# Altium schematic sheet 13_Periphs.SchDoc: Peripherals
size A3; Organization: Lime Microsystems; Address1: Surrey Tech Centre; Address2: Guildford GU2 7YG; Address3: Surrey; Address4: United Kingdom; Revision: v1.3; SheetNumber: 13; SheetTotal: 16
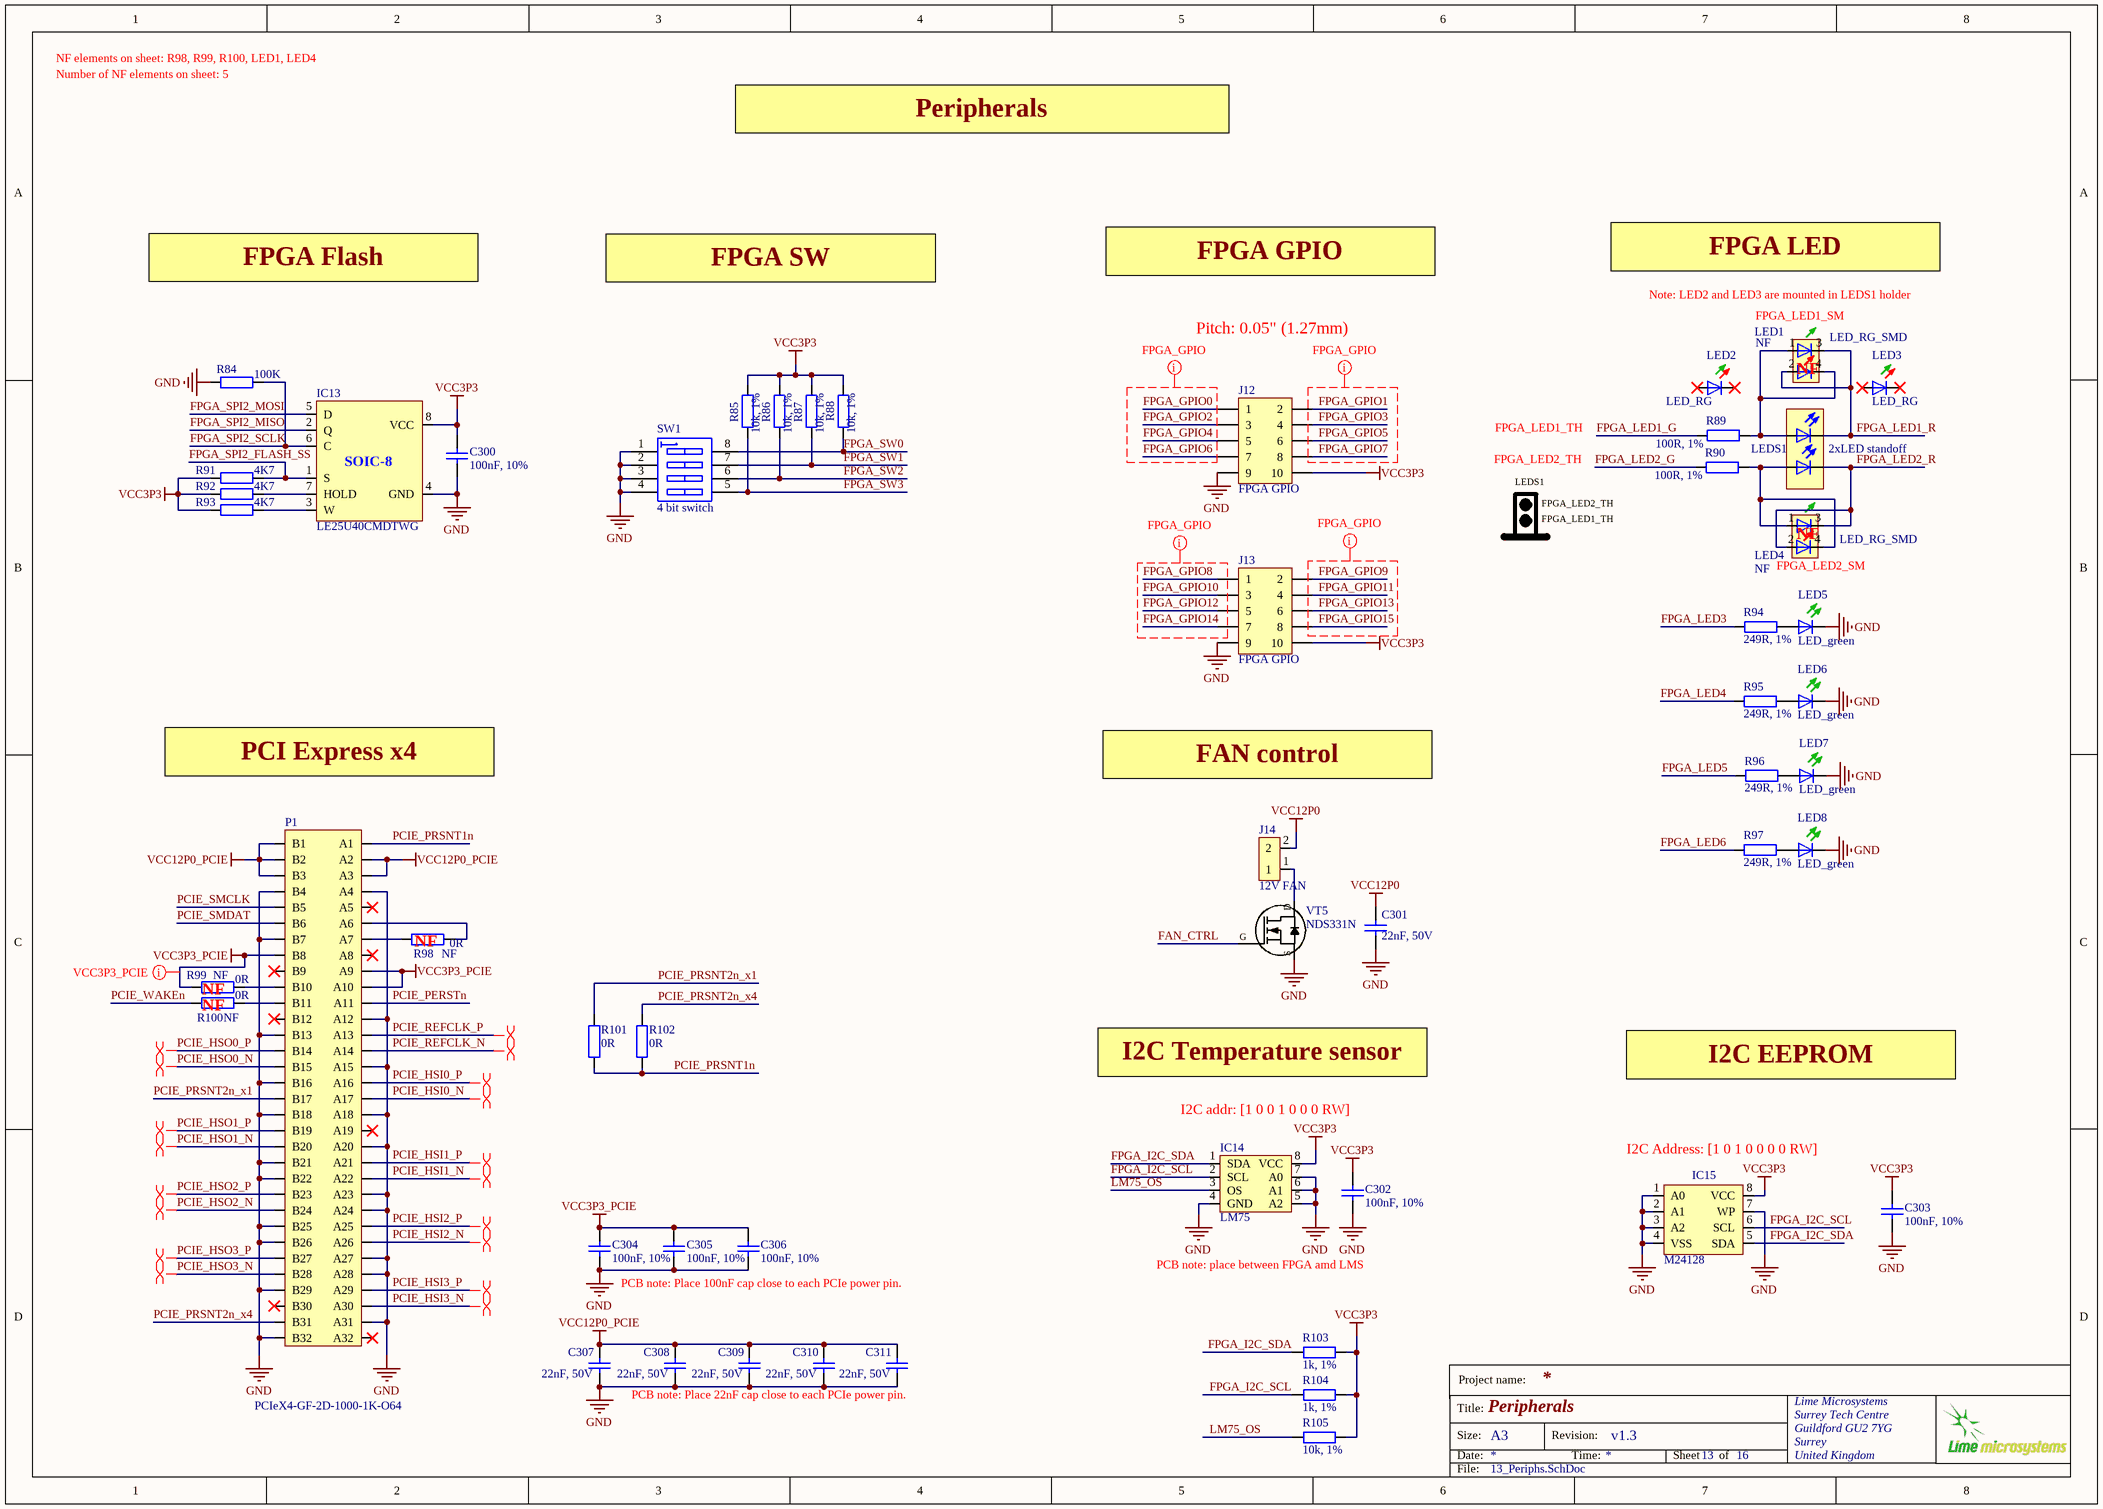
[diagram p0: 13_Periphs.SchDoc]

## Parts
C300  100nF, 10%  [CAP0402]
C301  22nF, 50V  [CAP0402]
C302  100nF, 10%  [CAP0402]
C303  100nF, 10%  [CAP0402]
C304  100nF, 10%  [CAP0402]
C305  100nF, 10%  [CAP0402]
C306  100nF, 10%  [CAP0402]
C307  22nF, 50V  [CAP0402]
C308  22nF, 50V  [CAP0402]
C309  22nF, 50V  [CAP0402]
C310  22nF, 50V  [CAP0402]
C311  22nF, 50V  [CAP0402]
IC13  LE25U40CMDTWG  [M25P40-VMN6TPB_SO8N]
IC14  LM75  [HWSON8_LM75]
IC15  M24128  [24FC512]
J12  FPGA GPIO  [SWD_10_pin]
J13  FPGA GPIO  [SWD_10_pin]
J14  12V FAN  [HDR_1x2]
LED1  LED_RG_SMD  Assembly Info: NF  [LED-2x0603]
LED2  LED_RG  (mechanical)
LED3  LED_RG  (mechanical)
LED4  LED_RG_SMD  Assembly Info: NF  [LED-2x0603]
LED5  LED_green  [LED-0603-GREEN]
LED6  LED_green  [LED-0603-GREEN]
LED7  LED_green  [LED-0603-GREEN]
LED8  LED_green  [LED-0603-GREEN]
LEDS1  2xLED standoff  [LED_STANDOFF_H-201C]
P1  PCIeX4-GF-2D-1000-1K-O64  [PCIeX4-GF-2D-1000-1K-O64]  (no BOM)
R84  100K  [RES0402]
R85  10k, 1%  [RES0402]
R86  10k, 1%  [RES0402]
R87  10k, 1%  [RES0402]
R88  10k, 1%  [RES0402]
R89  100R, 1%  [RES0402]
R90  100R, 1%  [RES0402]
R91  4K7  [RES0402]
R92  4K7  [RES0402]
R93  4K7  [RES0402]
R94  249R, 1%  [RES0402]
R95  249R, 1%  [RES0402]
R96  249R, 1%  [RES0402]
R97  249R, 1%  [RES0402]
R98  0R  Assembly Info: NF  [RES0402]
R99  0R  Assembly Info: NF  [RES0402]
R100  0R  Assembly Info: NF  [RES0402]
R101  0R  [RES0402]
R102  0R  [RES0402]
R103  1k, 1%  [RES0402]
R104  1k, 1%  [RES0402]
R105  10k, 1%  [RES0402]
SW1  4 bit switch  [SW_4WAY_SMD_1P27]
VT5  NDS331N  [SOT23-3]

## Nets
GND: C300.2 C301.2 C302.2 C303.2 C304.2 C305.2 C306.2 C307.2 C308.2 C309.2 C310.2 C311.2 IC13.4(GND) IC14.4(GND) IC14.5(A2) IC14.6(A1) IC14.7(A0) IC15.1(A0) IC15.2(A1) IC15.3(A2) IC15.4(VSS) IC15.7(WP) J12.9 J13.9 LED5.K(C) LED6.K(C) LED7.K(C) LED8.K(C) P1.A4 P1.A12 P1.A15 P1.A18 P1.A20 P1.A23 P1.A24 P1.A27 P1.A28 P1.A31 P1.B4 P1.B7 P1.B13 P1.B16 P1.B18 P1.B21 P1.B22 P1.B25 P1.B26 P1.B29 P1.B32 R84.1 SW1.1(A1) SW1.2(A2) SW1.3(A3) SW1.4(A4) VT5.S
VCC3P3: C300.1 C302.1 C303.1 IC13.8(VCC) IC14.8(VCC) IC15.8(VCC) J12.10 J13.10 R85.1 R86.1 R87.1 R88.1 R91.1 R92.1 R93.1 R103.1 R104.1 R105.1
VCC3P3_PCIE: C304.1 C305.1 C306.1 P1.A9 P1.A10 P1.B8 R99.1
VCC12P0: C301.1 J14.2
VCC12P0_PCIE: C307.1 C308.1 C309.1 C310.1 C311.1 P1.A2 P1.A3 P1.B1 P1.B2 P1.B3
FAN_CTRL: VT5.G
FPGA_GPIO0: J12.1
FPGA_GPIO1: J12.2
FPGA_GPIO2: J12.3
FPGA_GPIO3: J12.4
FPGA_GPIO4: J12.5
FPGA_GPIO5: J12.6
FPGA_GPIO6: J12.7
FPGA_GPIO7: J12.8
FPGA_GPIO8: J13.1
FPGA_GPIO9: J13.2
FPGA_GPIO10: J13.3
FPGA_GPIO11: J13.4
FPGA_GPIO12: J13.5
FPGA_GPIO13: J13.6
FPGA_GPIO14: J13.7
FPGA_GPIO15: J13.8
FPGA_I2C_SCL: IC14.2(SCL) IC15.6(SCL) R104.2
FPGA_I2C_SDA: IC14.1(SDA) IC15.5(SDA) R103.2
FPGA_LED1_G: R89.1
FPGA_LED1_R: LED1.2 LED1.3 LEDS1.K1(C)
FPGA_LED2_G: R90.1
FPGA_LED2_R: LED4.2 LED4.3 LEDS1.K2(C)
FPGA_LED3: R94.1
FPGA_LED4: R95.1
FPGA_LED5: R96.1
FPGA_LED6: R97.1
FPGA_SPI2_FLASH_SS: IC13.1(S) R91.2
FPGA_SPI2_MISO: IC13.2(Q)
FPGA_SPI2_MOSI: IC13.5(D)
FPGA_SPI2_SCLK: IC13.6(C) R84.2
FPGA_SW0: R88.2 SW1.8(B1)
FPGA_SW1: R87.2 SW1.7(B2)
FPGA_SW2: R86.2 SW1.6(B3)
FPGA_SW3: R85.2 SW1.5(B4)
LM75_OS: IC14.3(OS) R105.2
PCIE_HSI0_N: P1.A17
PCIE_HSI0_P: P1.A16
PCIE_HSI1_N: P1.A22
PCIE_HSI1_P: P1.A21
PCIE_HSI2_N: P1.A26
PCIE_HSI2_P: P1.A25
PCIE_HSI3_N: P1.A30
PCIE_HSI3_P: P1.A29
PCIE_HSO0_N: P1.B15
PCIE_HSO0_P: P1.B14
PCIE_HSO1_N: P1.B20
PCIE_HSO1_P: P1.B19
PCIE_HSO2_N: P1.B24
PCIE_HSO2_P: P1.B23
PCIE_HSO3_N: P1.B28
PCIE_HSO3_P: P1.B27
PCIE_PERSTn: P1.A11
PCIE_PRSNT1n: P1.A1 R101.1 R102.1
PCIE_PRSNT2n_x1: P1.B17 R101.2
PCIE_PRSNT2n_x4: P1.B31 R102.2
PCIE_REFCLK_N: P1.A14
PCIE_REFCLK_P: P1.A13
PCIE_SMCLK: P1.B5
PCIE_SMDAT: P1.B6
PCIE_WAKEn: R100.1
NetIC13_3: IC13.3(W) R93.2
NetIC13_7: IC13.7(HOLD) R92.2
NetJ14_1: J14.1 VT5.D
NetLED1_1: LED1.1 LED1.4 LEDS1.A1(A) R89.2
NetLED4_1: LED4.1 LED4.4 LEDS1.A2(A) R90.2
NetLED5_A: LED5.A R94.2
NetLED6_A: LED6.A R95.2
NetLED7_A: LED7.A R96.2
NetLED8_A: LED8.A R97.2
NetP1_A6: P1.A6 R98.2
NetP1_A7: P1.A7 R98.1
NetP1_B10: P1.B10 R99.2
NetP1_B11: P1.B11 R100.2

Not connected (* = marked no-connect by the designer): LED2 A* K(C)*; LED3 A* K(C)*; P1 A5* A8* A19* A32* B9* B12* B30*

## Layout directives
net class FPGA_GPIO: FPGA_GPIO0, FPGA_GPIO1, FPGA_GPIO2, FPGA_GPIO3, FPGA_GPIO4, FPGA_GPIO5, FPGA_GPIO6, FPGA_GPIO7, FPGA_GPIO8, FPGA_GPIO9, FPGA_GPIO10, FPGA_GPIO11, FPGA_GPIO12, FPGA_GPIO13, FPGA_GPIO14, FPGA_GPIO15
differential pair: PCIE_HSI0_N, PCIE_HSI0_P, PCIE_HSI1_N, PCIE_HSI1_P, PCIE_HSI2_N, PCIE_HSI2_P, PCIE_HSI3_N, PCIE_HSI3_P, PCIE_HSO0_N, PCIE_HSO0_P, PCIE_HSO1_N, PCIE_HSO1_P, PCIE_HSO2_N, PCIE_HSO2_P, PCIE_HSO3_N, PCIE_HSO3_P, PCIE_REFCLK_N, PCIE_REFCLK_P
net class VCC3P3_PCIE: VCC3P3_PCIE

## Notes on the sheet
- Number of NF elements on sheet: 5
- NF elements on sheet: R98, R99, R100, LED1, LED4
- Peripherals
- FPGA Flash
- FPGA SW
- FPGA GPIO
- FPGA LED
- (near LED1) Note: LED2 and LED3 are mounted in LEDS1 holder
- Pitch: 0.05" (1.27mm)
- (near LED1) FPGA_LED1_SM
- (near LED1) NF
- FPGA_LED1_TH
- FPGA_LED2_TH
- LEDS1
- (near LED4) FPGA_LED2_SM
- (near LED4) NF
- PCI Express x4
- FAN control
- (near R98) NF
- (near R100) NF
- (near R99) NF
- I2C Temperature sensor
- I2C addr: [1 0 0 1 0 0 0 RW]
- I2C EEPROM
- (near IC15) I2C Address: [1 0 1 0 0 0 0 RW]
- PCB note: Place 100nF cap close to each PCIe power pin.
- PCB note: place between FPGA amd LMS
- PCB note: Place 22nF cap close to each PCIe power pin.
- Project name:
- Title:
- Size:
- Date:
- A3
- Revision:
- Time:
- Sheet
- of
- File:
- (in symbol M25P40) SOIC-8

## Library data of the parts
C300 C302 C303 = Cap_0603: Manufacturer Part Number 1: GRM155R71C104KA88D; Part Description: 0.10µF ±10% 16V X7R Ceramic Capacitor -55°C ~ 125°C Surface Mount, MLCC 0402 (1005 Metric) 0.039" L x 0.020" W (1.00mm x 0.50mm); Brand: Murata Electronics; Type: General Purpose MLCC; Capacitance: 0.1 uF; Temperature Coefficient / Code: +/- 15 %; Voltage Rating DC: 16 V; Supplier 1: Mouser; Supplier Part Number 1: 81-GRM155R71C104KA88; Tolerance: 10 %; Case Code - in: 0402; Manufacturer: Murata Electronics; Category: Multilayer Ceramic Capacitors MLCC - SMD/SMT; Value: 100nF, 10%; Manufacturer Part Number: GRM155R71C104KA88D; Maximum Operating Temperature: + 125 C; Minimum Operating Temperature: - 55 C; Minimum Order Quantity: 1; Operating Temperature Range: - 55 C to + 125 C; Package / Case: 0402 (1005 metric); Packaging: Reel; Product: General Type MLCCs; Product Category: Low & Medium Capacitance SMD Ceramic Chip Capacitors; Reeling: True; RoHS - Mouser: Y; RoHS: RoHS Compliant; Series: GRM; Standard Pack Qty: 10000; Termination Style: SMD/SMT
C301 C307-C311 = Cap_0402: Manufacturer: Kemet; Manufacturer Part Number 1: C0402C223K5RACTU; Part Description: 0.022µF ±10% 50V X7R Ceramic Capacitor -55°C ~ 125°C Surface Mount, MLCC 0402 (1005 Metric) 0.039" L x 0.020" W (1.00mm x 0.50mm); Temperature Coefficient: X7R; Tolerance: ±10%; Capacitance: 0.022µF; Value: 22nF, 50V; Supplier 1: Digi-Key; Supplier Part Number 1: 399-7780-1-ND; Ratings: -; Packaging: Cut Tape (CT); Category: Capacitors; Size / Dimension: 0.039" L x 0.020" W (1.00mm x 0.50mm); RoHS: RoHS Compliant; Operating Temperature: -55°C ~ 125°C; Mounting Type: Surface Mount, MLCC; Applications: General Purpose; Voltage - Rated: 50V; Thickness (Max): 0.022" (0.55mm); Features: -; Height - Seated (Max): -; Lead Style: -; Package / Case: 0402 (1005 Metric); Lead Spacing: -
C304-C306 = Cap_0603: Part Description: 0.10µF ±10% 16V X7R Ceramic Capacitor -55°C ~ 125°C Surface Mount, MLCC 0402 (1005 Metric) 0.039" L x 0.020" W (1.00mm x 0.50mm); Manufacturer Part Number 1: GRM155R71C104KA88D; Brand: Murata Electronics; Type: General Purpose MLCC; Capacitance: 0.1 uF; Temperature Coefficient / Code: +/- 15 %; Voltage Rating DC: 16 V; Supplier 1: Mouser; Supplier Part Number 1: 81-GRM155R71C104KA88; Tolerance: 10 %; Case Code - in: 0402; Manufacturer: Murata Electronics; Category: Multilayer Ceramic Capacitors MLCC - SMD/SMT; Value: 100nF, 10%; Manufacturer Part Number: GRM155R71C104KA88D; Maximum Operating Temperature: + 125 C; Minimum Operating Temperature: - 55 C; Minimum Order Quantity: 1; Operating Temperature Range: - 55 C to + 125 C; Package / Case: 0402 (1005 metric); Packaging: Reel; Product: General Type MLCCs; Product Category: Low & Medium Capacitance SMD Ceramic Chip Capacitors; Reeling: True; RoHS - Mouser: Y; RoHS: RoHS Compliant; Series: GRM; Standard Pack Qty: 10000; Termination Style: SMD/SMT
IC13 = M25P40: Part Description: IC FLASH 4MBIT 40MHZ 8SOIC; Manufacturer: ON Semiconductor; Memory Format: FLASH; Memory Size: 4M (512K x 8); Speed: 40MHz; Interface: SPI Serial; Voltage - Supply: 2.3 V ~ 3.6 V; Supplier 1: Digi-Key; Supplier Part Number 1: LE25U40CMDTWGOSCT-ND; Manufacturer Part Number 1: LE25U40CMDTWG; RoHS: RoHS Compliant; Description: IC FLASH 4MBIT 40MHZ 8SOIC; Category: Integrated Circuits (ICs); Stock 1: 1851; Pricing 1: 1=0.54, 10=0.529, 100=0.4338, 500=0.42176, 1000=0.41046 (USD); Packaging: Cut Tape (CT); Part Status: Active; Memory Type: FLASH; Operating Temperature: -40°C ~ 85°C (TA); Package / Case: 8-SOIC (0.154", 3.90mm Width); Supplier Device Package: 8-SOIC; ComponentLink1URL: http://www.onsemi.com/pub_link/Collateral/LE25U40CMD-D.PDF; ComponentLink1Description: http://www.onsemi.com/pub_link/Collateral/LE25U40CMD-D.PDF
IC14 = LM75: Manufacturer: NXP Semiconductors; Manufacturer Part Number: LM75BTP,147; Part Description: SENSOR TEMPERATURE I2C 8HWSON; Sensing Temperature - Local: -55°C ~ 125°C; Output Type: I²C; Accuracy - Highest (Lowest): ±2°C (±3°C); Voltage - Supply: 2.8 V ~ 5.5 V; Test Condition: -25°C ~ 100°C (-55°C ~ 125°C); Sensor Type: Digital, Local; Resolution: 10 b; Supplier 1: Digi-Key; Operating Temperature: -55°C ~ 125°C; Features: Output Switch, Programmable Limit, Shutdown Mode; Supplier Device Package: 8-HWSON (2x3); Sensing Temperature - Remote: -; Category: Sensors, Transducers; Packaging: Tape & Reel (TR); RoHS: RoHS Compliant; Package / Case: 8-WFDFN Exposed Pad; Supplier Part Number 1: 568-9815-2-ND
IC15 = 24FC64F: Part Description: IC EEPROM 128KBIT 1MHZ 8TSSOP; Manufacturer: STMicroelectronics; Manufacturer Part Number 1: M24128-DRDW8TP/K; Format - Memory: EEPROMs - Serial; Memory Type: EEPROM; Memory Size: 128K (16K x 8); Speed: 1MHz; Interface: I²C, 2-Wire Serial; Voltage - Supply: 1.8 V ~ 5.5 V; Supplier 1: Digi-Key; Supplier Part Number 1: 497-15336-1-ND; RoHS: RoHS Compliant; Category: Integrated Circuits (ICs); Stock 1: 1677; Pricing 1: 1=0.47, 10=0.464, 100=0.3805, 500=0.36996, 1000=0.36005 (USD); Packaging: Cut Tape (CT); Part Status: Active; Operating Temperature: -40°C ~ 105°C (TA); Package / Case: 8-TSSOP (0.173", 4.40mm Width); Supplier Device Package: 8-TSSOP; ComponentLink1URL: http://www.st.com/content/ccc/resource/technical/document/datasheet/5c/f3/4b/70/8e/63/48/95/DM00149696.pdf/files/DM00149696.pdf/jcr:content/translations/en.DM00149696.pdf; ComponentLink1Description: http://www.st.com/content/ccc/resource/technical/document/datasheet/5c/f3/4b/70/8e/63/48/95/DM00149696.pdf/files/DM00149696.pdf/jcr:content/translations/en.DM00149696.pdf
J12 J13 = Header 5X2_SWD: Header, 5-Pin, Dual row; Manufacturer Part Number 1: M50-3600542; Manufacturer: Harwin Inc; Part Description: CONN HDR 1.27MM SMD AU 10POS; Number of Positions: 10; Molding Height Above Board: 0.039" (1.00mm); Row Spacing: 0.050" (1.27mm); Number of Positions Loaded: All; Connector Type: Unshrouded; Supplier 1: Digi-Key; Contact Mating Length: 0.118" (3.00mm); Category: Connectors, Interconnects; Color: Black; RoHS: RoHS Compliant; Number of Rows: 2; Contact Finish Thickness: 3µin (0.08µm); Height Stacking (Mating): -; Contact Finish: Gold; Termination: Solder; Mounting Type: Surface Mount; Pitch: 0.050" (1.27mm); Features: -; Packaging: Bulk; Supplier Part Number 1: 952-1389-ND
J14 = Jumper: Manufacturer Part Number 1: 961102-6404-AR; Part Description: 2 Positions Header, Unshrouded Connector 0.100" (2.54mm) Through Hole Gold; Manufacturer: 3M; Connector Type: Header, Unshrouded; Supplier 1: Digi-Key; Supplier Part Number 1: 3M9447-ND; Contact Type: Male Pin; Color: Black; Mounting Type: Through Hole; Category: Connectors, Interconnects; Contact Finish: Gold
LED1 LED4 = LED_green_red_SMD: Manufacturer Part Number 1: HSMF-C165; Manufacturer: Avago Technologies US Inc.; Part Description: LED GREEN/RED DIFFUSED 0603 SMD; Millicandela Rating: 15mcd Green, 10mcd Red; Lens Transparency: Diffused; Lens Color: White; Lens Style/Size: Rectangle with Flat Top, 1.60mm x 0.80mm; Wavelength - Peak: 570nm Green, 636nm Red; Wavelength - Dominant: 572nm Green, 621nm Red; Viewing Angle: 120°; Voltage - Forward (Vf) (Typ): 2.2V Green, 1.95V Red; Current - Test: 20mA; Color: Green, Red; Supplier 1: Digi-Key; Height (Max): 0.50mm; Packaging: Cut Tape (CT); Category: Optoelectronics; Mounting Type: Surface Mount; Package / Case: 0603 (1608 Metric); Size / Dimension: 1.60mm L x 0.80mm W; Supplier Device Package: *; RoHS: RoHS Compliant; Supplier Part Number 1: 516-1419-1-ND
LED2 LED3 = LED_green_red: Manufacturer Part Number 1: 4301F1/5; Manufacturer: Visual Communications Company - VCC; Part Description: LED GRN/RED DIFF 3MM ROUND T/H; Voltage - Forward (Vf) (Typ): 2.1V Green, 1.8V Red; Lens Color: White; Lens Style/Size: Round with Domed Top, 3mm (T-1), 2.90mm; Millicandela Rating: 12.6mcd Green, 3.7mcd Red; Color: Green, Red; Viewing Angle: 100°; Lens Transparency: Diffused; Current - Test: 20mA Green, 20mA Red; Wavelength - Peak: 565nm Green, 660nm Red; Supplier 1: Digi-Key; Supplier Part Number 1: 4301F1/5-ND; RoHS: RoHS Compliant; Packaging: Bulk; Package / Case: Radial; Mounting Type: Through Hole; Wavelength - Dominant: -; Supplier Device Package: T-1; Size / Dimension: -; Category: Optoelectronics; Height (Max): 5.44mm
LED5-LED8 = LED_green: Part Description: LED GREEN DIFFUSED 0603 SMD; Manufacturer: Broadcom Limited; Current - Test: 20mA; Voltage - Forward (Vf) (Typ): 2.2V; Color: Green; Supplier 1: Digi-Key; Supplier Part Number 1: 516-1425-2-ND; Category: Optoelectronics; Package / Case: 0603 (1608 Metric)
LEDS1 = LEDx2_STANDOFF: Manufacturer Part Number 1: H-201C; Manufacturer: Bivar Inc.; Part Description: LED HOLDER RA 3MM 2LD NYL BK; LED: T1; Supplier 1: Digi-Key; Supplier Part Number 1: 492-1790-ND; Category: Optoelectronics; RoHS: RoHS Compliant; Color: Black; Length: 0.380" (9.65mm); Material: Nylon
R84 = Res_0402: Manufacturer Part Number 1: ERJ-2GEJ104X; Manufacturer: Panasonic Electronic Components; Part Description: RES SMD 100K OHM 5% 1/10W 0402; Tolerance: ±5%; Temperature Coefficient: ±200ppm/°C; Power (Watts): 0.1W, 1/10W; Value: 100K; Supplier 1: Digi-Key; Supplier Part Number 1: P100KJCT-ND; Resistance (Ohms): 100k; Composition: Thick Film; Features: Automotive AEC-Q200; Number of Terminations: 2; Height: 0.016" (0.40mm); RoHS: RoHS Compliant; Package / Case: 0402 (1005 Metric); Packaging: Cut Tape (CT); Size / Dimension: 0.039" L x 0.020" W (1.00mm x 0.50mm); Supplier Device Package: 0402; Operating Temperature: -55°C ~ 155°C; Category: Resistors
R85-R88 R105 = Res_0402: Manufacturer: Yageo; Manufacturer Part Number 1: RC0402FR-0710KL; Part Description: RES SMD 10K OHM 1% 1/16W 0402; Temperature Coefficient: ±100ppm/°C; Power (Watts): 0.063W, 1/16W; Value: 10k, 1%; Supplier 1: Digi-Key; Supplier Part Number 1: 311-10.0KLRTR-ND; Resistance (Ohms): 10k; Packaging: Tape & Reel (TR); RoHS: RoHS Compliant; Package / Case: 0402 (1005 Metric); Tolerance: ±1%; Operating Temperature: -55°C ~ 155°C; Size / Dimension: 0.039" L x 0.020" W (1.00mm x 0.50mm); Number of Terminations: 2; Category: Resistors; Height: 0.016" (0.40mm); Supplier Device Package: 0402; Features: Moisture Resistant; Composition: Thick Film
R89 R90 = Res_0402: Manufacturer Part Number 1: RMCF0402FT100R; Manufacturer: Stackpole Electronics Inc.; Part Description: RES SMD 100 OHM 1% 1/16W 0402; Power (Watts): 0.063W, 1/16W; Temperature Coefficient: ±100ppm/°C; Resistance (Ohms): 100; Value: 100R, 1%; Supplier 1: Digi-Key; Supplier Part Number 1: RMCF0402FT100RDKR-ND; Packaging: Digi-Reel®; Composition: Thick Film; Number of Terminations: 2; Package / Case: 0402 (1005 Metric); RoHS: RoHS Compliant; Category: Resistors; Size / Dimension: 0.039" L x 0.020" W (1.00mm x 0.50mm); Tolerance: ±1%; Supplier Device Package: 0402; Features: -; Height: 0.016" (0.40mm); Operating Temperature: -55°C ~ 155°C
R91-R93 = Res_0402: Manufacturer Part Number 1: RMCF0402JT4K70; Part Description: RES SMD 4.7K OHM 5% 1/16W 0402; Manufacturer: Stackpole Electronics Inc.; Temperature Coefficient: ±100ppm/°C; Resistance(Ohms): 4.7k; Tolerance: ±5%; Supplier 1: Digi-Key; Composition: Thick Film; Supplier Device Package: 0402; Supplier: Digi-Key; Supplier Part Number 1: RMCF0402JT4K70TR-ND; Category: Resistors; Value: 4K7
R94-R97 = Res_0402: Manufacturer Part Number 1: RMCF0402FT249R; Manufacturer: Stackpole Electronics Inc; Part Description: RMCF0402FT249RCT-ND; Resistance (Ohms): 249; Power (Watts): 0.063W, 1/16W; Temperature Coefficient: ±100ppm/°C; Value: 249R, 1%; Supplier 1: Digi-Key; Supplier Part Number 1: RMCF0402FT249RCT-ND; Package / Case: 0402 (1005 Metric); Features: -; Size / Dimension: 0.039" L x 0.020" W (1.00mm x 0.50mm); Category: Resistors; Operating Temperature: -55°C ~ 155°C; Packaging: Cut Tape (CT); Tolerance: ±1%; Supplier Device Package: 0402; RoHS: RoHS Compliant; Composition: Thick Film; Number of Terminations: 2; Height: 0.016" (0.40mm)
R98-R102 = Res_0402: Manufacturer: Yageo; Part Description: RES SMD 0.0OHM JUMPER 1/16W 0402; Supplier 1: Digi-Key; Supplier Part Number 1: 311-0.0JRTR-ND; Composition: Thick Film; Package / Case: 0402 (1005 Metric); Category: Resistors; Value: 0R
R103 R104 = Res_0402: Manufacturer: Stackpole Electronics Inc; Manufacturer Part Number 1: RMCF0402FT1K00; Part Description: RES SMD 1K OHM 1% 1/16W 0402; Temperature Coefficient: ±100ppm/°C; Power (Watts): 0.063W, 1/16W; Value: 1k, 1%; Supplier 1: Digi-Key; Supplier Part Number 1: RMCF0402FT1K00TR-ND; Package / Case: 0402 (1005 Metric); Supplier Device Package: 0402; Height: 0.016" (0.40mm); Size / Dimension: 0.039" L x 0.020" W (1.00mm x 0.50mm); Number of Terminations: 2; Packaging: Cut Tape (CT); Category: Resistors; Composition: Thick Film; Resistance (Ohms): 1k; Tolerance: ±1%; Features: Moisture Resistant; Operating Temperature: -55°C ~ 155°C; RoHS: RoHS Compliant
SW1 = SW_SM_4bit: Manufacturer Part Number 1: A6H-4101; Manufacturer: Omron Electronics Inc-EMC Div; Part Description: SWITCH DIP 4POLES STD SMD 24V; Pitch: 0.050" (1.27mm), Half; Mechanical Life: 1,000 Cycles; Washable: No; Current Rating: 25mA; Number of Positions: 4; Voltage Rating: 24VDC; Actuator Level: Flush, Recessed; Circuit: SPST; Actuator Type: Slide (Standard); Supplier 1: Digi-Key; Height Above Board: 0.061" (1.55mm); RoHS: RoHS Compliant; Termination Style: Gull Wing; Electrical Life: 1,000 Cycles; Length: 0.248" (6.31mm); Category: Switches; Operating Temperature: -20°C ~ 70°C; Body Material: -; Contact Material: -; Features: -; Mounting Type: Surface Mount; Contact Finish: -; Packaging: Tube; Supplier Part Number 1: SW1080-ND
VT5 = NDS331N: Part Description: MOSFET N-CH 20V 1.3A SSOT3; Manufacturer: FAIRCHILD SEMICONDUCTOR; Gate Charge (Qg) @ Vgs: 5nC @ 4.5V; Power - Max: 460mW; Current - Continuous Drain (Id) @ 25°C: 1.3A (Ta); Input Capacitance (Ciss) @ Vds: 162pF @ 10V; FET Type: MOSFET N-Channel, Metal Oxide; Drain to Source Voltage (Vdss): 20V; FET Feature: Logic Level Gate; Supplier Device Package: 3-SSOT; Category: Discrete Semiconductor Products; Mounting Type: Surface Mount; Package / Case: TO-236-3, SC-59, SOT-23-3; Supplier 1: Digi-Key; Supplier Part Number 1: NDS331NCT-ND; Manufacturer Part Number: NDS331N